# Altium schematic sheet encoders.SchDoc
size 209 x 297 mm; DocumentCode: Децимальный номер; SchemeType: Схема электрическая принципиальная; TitleLine1: Название проекта (строка 1); TitleLine2: Название проекта (строка 2); PageSetup: Record=PageOptionsZCenterHorizontal=TrueZCenterVertical=TrueZPrintScale=0.95ZXCorrection=1.00ZYCorrection=1.00ZPrintKind=2ZBorderSize=5000000ZLeftOffset=0ZBottomOffset=0ZOrientation=1ZPaperLength=1000ZPaperWidth=1000ZScale=100ZPaperSource=7ZPrintQuality=600ZMediaType=1ZDitherType=10ZPaperKind=A4 (210 x 297 мм)ZPrintScaleMode=1
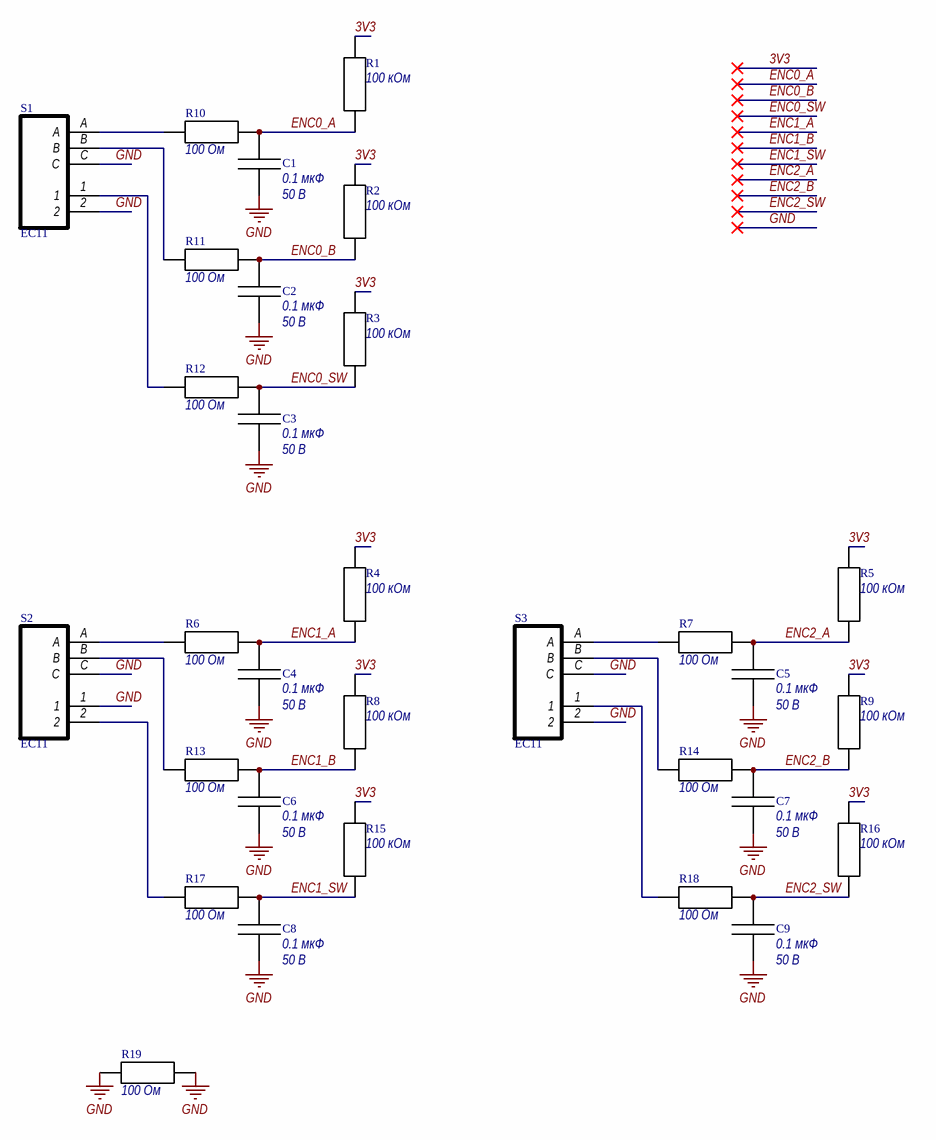
[diagram p0: encoders.SchDoc]

## Parts
C1  value 0.1 мкФ  Voltage: 50 В  [0805-CAP]  (hidden comment: GRM21BR71H104K)
C2  value 0.1 мкФ  Voltage: 50 В  [0805-CAP]  (hidden comment: GRM21BR71H104K)
C3  value 0.1 мкФ  Voltage: 50 В  [0805-CAP]  (hidden comment: GRM21BR71H104K)
C4  value 0.1 мкФ  Voltage: 50 В  [0805-CAP]  (hidden comment: GRM21BR71H104K)
C5  value 0.1 мкФ  Voltage: 50 В  [0805-CAP]  (hidden comment: GRM21BR71H104K)
C6  value 0.1 мкФ  Voltage: 50 В  [0805-CAP]  (hidden comment: GRM21BR71H104K)
C7  value 0.1 мкФ  Voltage: 50 В  [0805-CAP]  (hidden comment: GRM21BR71H104K)
C8  value 0.1 мкФ  Voltage: 50 В  [0805-CAP]  (hidden comment: GRM21BR71H104K)
C9  value 0.1 мкФ  Voltage: 50 В  [0805-CAP]  (hidden comment: GRM21BR71H104K)
R1  value 100 кОм  [0805-RES]  (hidden comment: RC0805FR-07100KL)
R2  value 100 кОм  [0805-RES]  (hidden comment: RC0805FR-07100KL)
R3  value 100 кОм  [0805-RES]  (hidden comment: RC0805FR-07100KL)
R4  value 100 кОм  [0805-RES]  (hidden comment: RC0805FR-07100KL)
R5  value 100 кОм  [0805-RES]  (hidden comment: RC0805FR-07100KL)
R6  value 100 Ом  [0805-RES]  (hidden comment: RC0805FR-07100RL)
R7  value 100 Ом  [0805-RES]  (hidden comment: RC0805FR-07100RL)
R8  value 100 кОм  [0805-RES]  (hidden comment: RC0805FR-07100KL)
R9  value 100 кОм  [0805-RES]  (hidden comment: RC0805FR-07100KL)
R10  value 100 Ом  [0805-RES]  (hidden comment: RC0805FR-07100RL)
R11  value 100 Ом  [0805-RES]  (hidden comment: RC0805FR-07100RL)
R12  value 100 Ом  [0805-RES]  (hidden comment: RC0805FR-07100RL)
R13  value 100 Ом  [0805-RES]  (hidden comment: RC0805FR-07100RL)
R14  value 100 Ом  [0805-RES]  (hidden comment: RC0805FR-07100RL)
R15  value 100 кОм  [0805-RES]  (hidden comment: RC0805FR-07100KL)
R16  value 100 кОм  [0805-RES]  (hidden comment: RC0805FR-07100KL)
R17  value 100 Ом  [0805-RES]  (hidden comment: RC0805FR-07100RL)
R18  value 100 Ом  [0805-RES]  (hidden comment: RC0805FR-07100RL)
R19  value 100 Ом  [0805-RES]  (hidden comment: RC0805FR-07100RL)
S1  EC11  [482020514001]
S2  EC11  [482020514001]
S3  EC11  [482020514001]

## Nets
GND: C1.1 C2.1 C3.1 C4.1 C5.1 C6.1 C7.1 C8.1 C9.1 R19.1 R19.2 S1.2 S1.C S2.1 S2.C S3.2 S3.C
3V3: R1.2 R2.2 R3.2 R4.2 R5.2 R8.2 R9.2 R15.2 R16.2
ENC0_A: C1.2 R1.1 R10.1
ENC0_B: C2.2 R2.1 R11.1
ENC0_SW: C3.2 R3.1 R12.1
ENC1_A: C4.2 R4.1 R6.1
ENC1_B: C6.2 R8.1 R13.1
ENC1_SW: C8.2 R15.1 R17.1
ENC2_A: C5.2 R5.1 R7.1
ENC2_B: C7.2 R9.1 R14.1
ENC2_SW: C9.2 R16.1 R18.1
NetR6_2: R6.2 S2.A
NetR7_2: R7.2 S3.A
NetR10_2: R10.2 S1.A
NetR11_2: R11.2 S1.B
NetR12_2: R12.2 S1.1
NetR13_2: R13.2 S2.B
NetR14_2: R14.2 S3.B
NetR17_2: R17.2 S2.2
NetR18_2: R18.2 S3.1

## Notes on the sheet
- Перв. примен.
- Справ. №
- Подп. и дата
- Инв. № дубл.
- Взам. инв. №
- Разраб.
- Изм.
- Лист
- № докум.
- Подп.
- Дата
- Лит.
- Масса
- Масштаб
- Пров.
- Т. контр.
- Листов
- Н. контр.
- Утв.
- Нач. лаб.
- Инв. № подл.
- Копировал
- Формат А4

## Library data of the parts
C1-C9 = CMP-0544-A.1: Конденсатор керамический, 0.1 мкФ, X7R, 50 В, точность 10%, 0805; Accuracy: 10%
R1-R5 R8 R9 R15 R16 = CMP-0672-A.2: Резистор, 100 кОм, 0.125 Вт, точность 1%, 0805; Manufacturer: YAGEO; Accuracy: 1%; Temperature: -55 - 155°C
R6 R7 R10-R14 R17-R19 = CMP-0727-A.1: Резистор, 100 Ом, 0.125 Вт, точность 1%, 0805; Manufacturer: YAGEO; Accuracy: 1%; Temperature: -55 - 155°C
S1-S3 = CMP-0735-A.1: Энкодер, с кнопкой, монтаж в отверстия; Manufacturer: NA; Temperature: NA